# EAGLE schematic LeatherSynth (EAGLE 6.4)
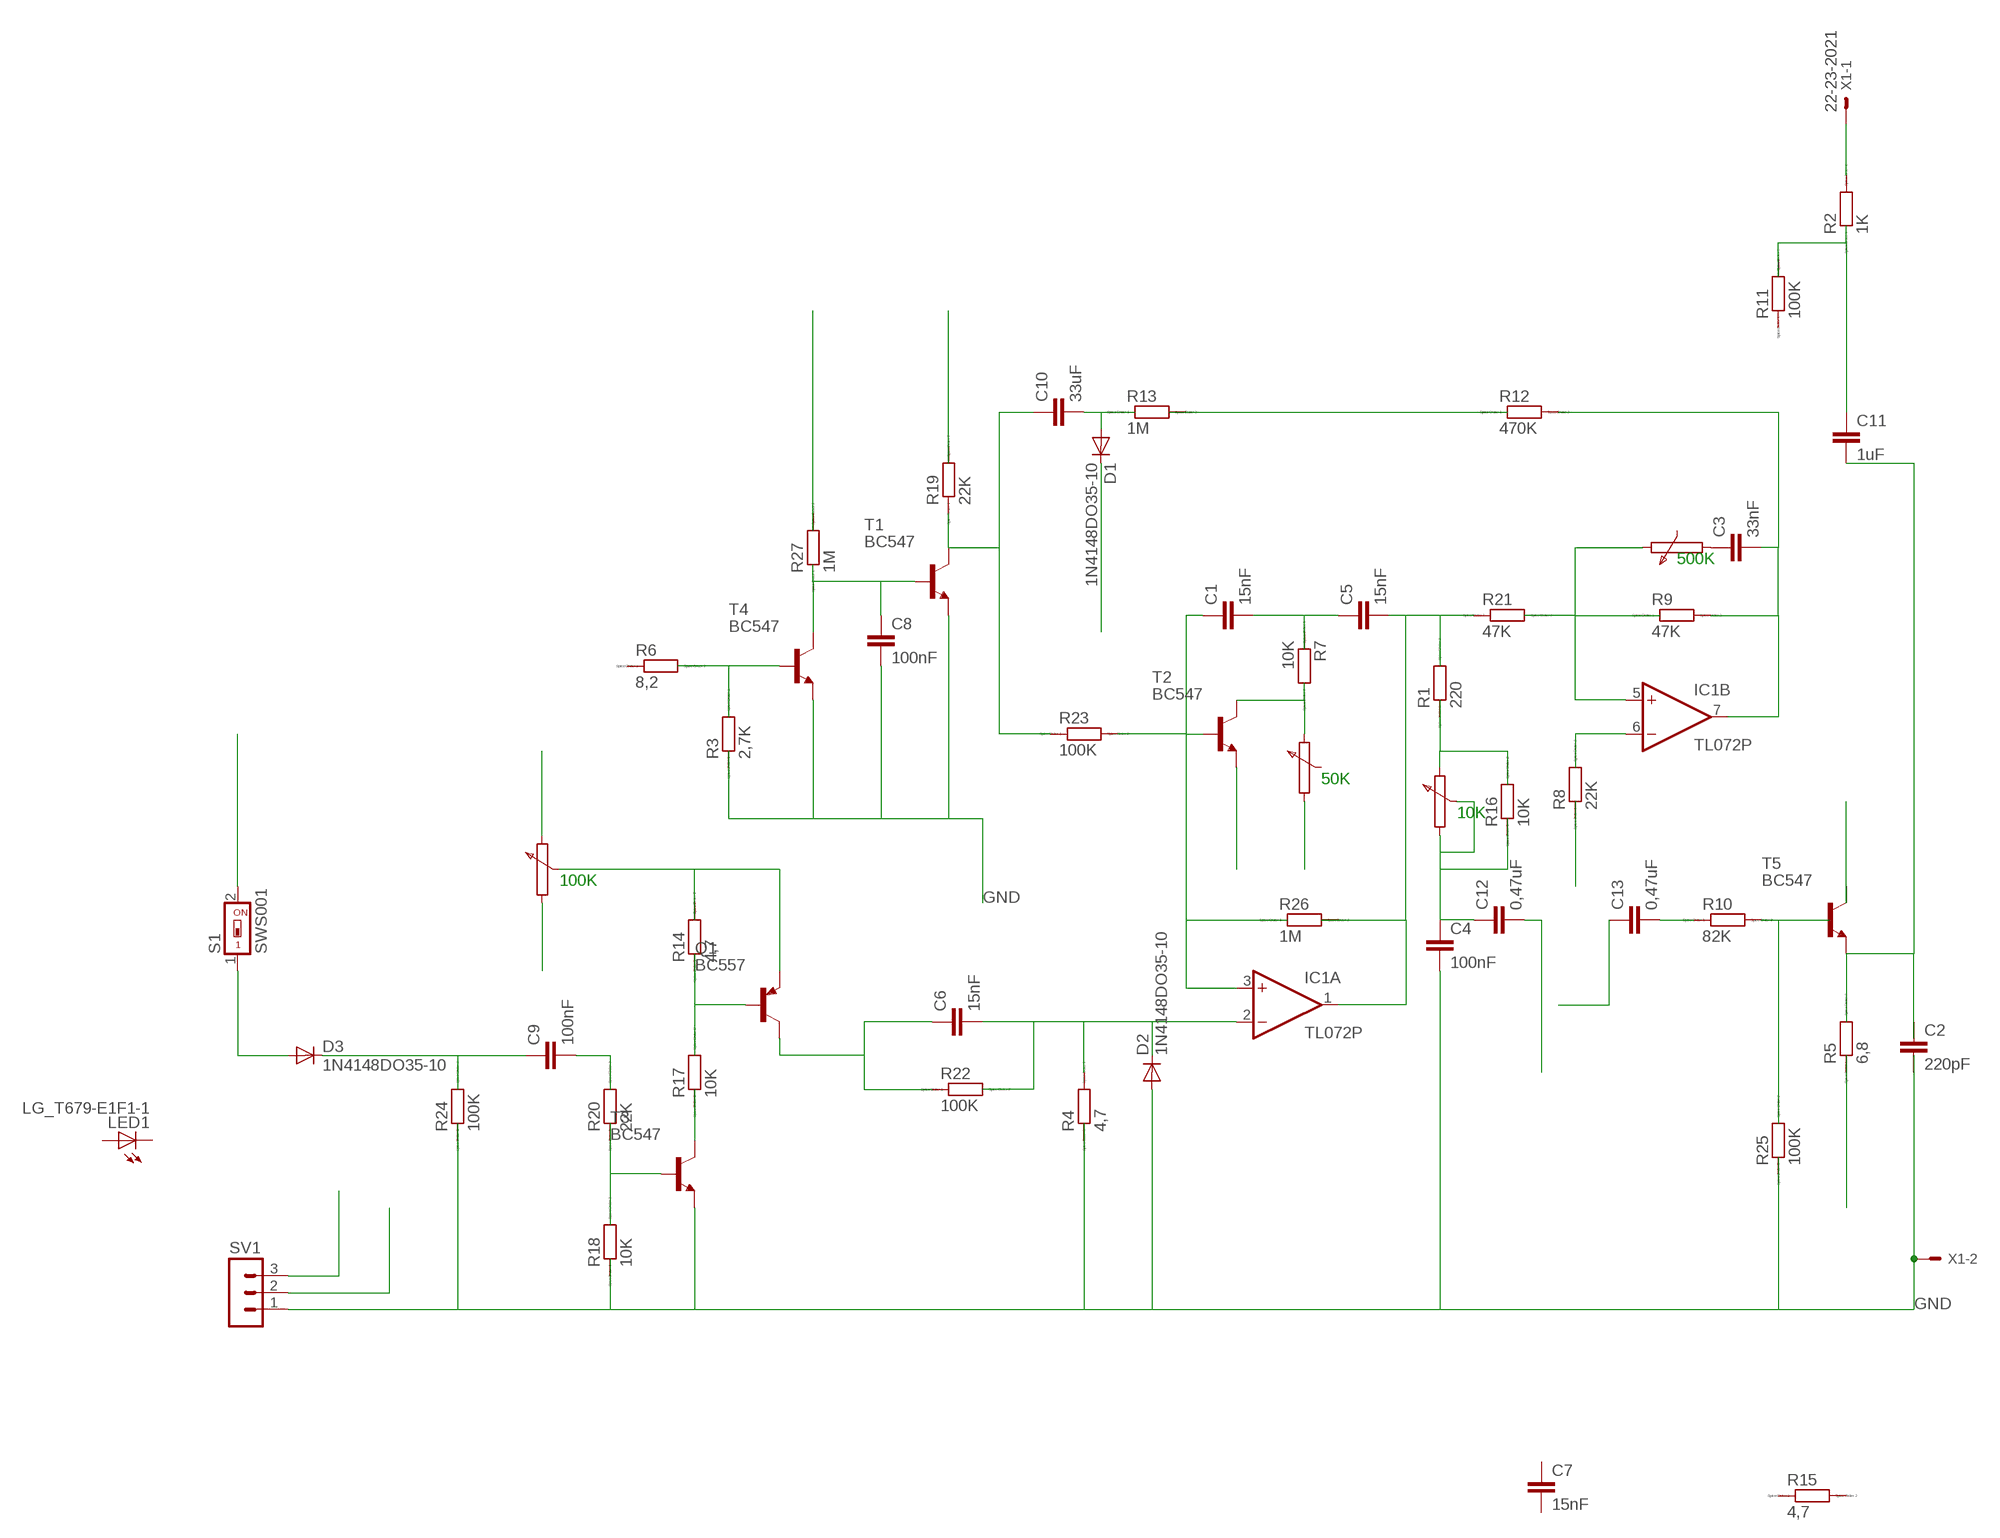
[diagram p0: schematic, sheet 1]

## Parts
C1  15nF  C-EUC2220K  [C2220K]
C2  220pF  C-EUC2220K  [C2220K]
C3  33nF  C-EUC2220K  [C2220K]
C4  100nF  C-EUC2220K  [C2220K]
C5  15nF  C-EUC2220K  [C2220K]
C6  15nF  C-EUC2220K  [C2220K]
C7  15nF  C-EUC2220K  [C2220K]
C8  100nF  C-EUC2220K  [C2220K]
C9  100nF  C-EUC2220K  [C2220K]
C10  33uF  C-EUC2220K  [C2220K]
C11  1uF  C-EUC2220K  [C2220K]
C12  0,47uF  C-EUC2220K  [C2220K]
C13  0,47uF  C-EUC2220K  [C2220K]
D1  1N4148DO35-10  [DO35-10]
D2  1N4148DO35-10  [DO35-10]
D3  1N4148DO35-10  [DO35-10]
IC1  TL072P  [DIL08]
LED1  LG_T679-E1F1-1  [PLCC2]
Q1  BC557  [TO92]
R1  220  RR2010  [R2010]
R2  1K  RR2010  [R2010]
R3  2,7K  RR2010  [R2010]
R4  4,7  RR2010  [R2010]
R5  6,8  RR2010  [R2010]
R6  8,2  RR2010  [R2010]
R7  10K  RR2010  [R2010]
R8  22K  RR2010  [R2010]
R9  47K  RR2010  [R2010]
R10  82K  RR2010  [R2010]
R11  100K  RR2010  [R2010]
R12  470K  RR2010  [R2010]
R13  1M  RR2010  [R2010]
R14  4,7  RR2010  [R2010]
R15  4,7  RR2010  [R2010]
R16  10K  RR2010  [R2010]
R17  10K  RR2010  [R2010]
R18  10K  RR2010  [R2010]
R19  22K  RR2010  [R2010]
R20  22K  RR2010  [R2010]
R21  47K  RR2010  [R2010]
R22  100K  RR2010  [R2010]
R23  100K  RR2010  [R2010]
R24  100K  RR2010  [R2010]
R25  100K  RR2010  [R2010]
R26  1M  RR2010  [R2010]
R27  1M  RR2010  [R2010]
S1  SWS001  [SMS-001]
SV1  MA03-1  [MA03-1]
T1  BC547  [TO92]
T2  BC547  [TO92]
T3  BC547  [TO92]
T4  BC547  [TO92]
T5  BC547  [TO92]
X1  22-23-2021  [22-23-2021]

## Nets
GND: C4.2 C8.2 D2.A SV1.1 T1.1(E) T3.1(E) T4.1(E) X1.2
N$2: C3.2 IC1.7(B:OUT) R9.2 R12.2
N$3: C10.1 R19.1 R23.1 T1.3(C)
N$4: IC1.5(B:+IN)
N$5: IC1.6(B:-IN)
N$7: C5.2 IC1.1(A:OUT) R21.1
N$10: C12.2
N$11: C13.1
N$12: C13.2 R10.1
N$13: R10.2
N$15: C11.1 R2.1
N$16: C11.2 T5.1(E)
N$17: SV1.3
N$18: C10.2 D1.A
N$19: SV1.2
N$20: C1.2 C5.1
N$21: R7.2 T2.3(C)
N$23: T2.1(E)
N$24: C1.1 IC1.3(A:+IN) R23.2 T2.2(B)
N$25: D1.C
N$26: C6.2 D2.C IC1.2(A:-IN) R4.2
N$31: C8.1 R27.1 T1.2(B) T4.3(C)
N$34: T4.2(B)
N$38: C6.1 Q1.3(C) R22.1
N$39: Q1.1(E)
N$42: Q1.2(B)
N$43: T3.3(C)
N$45: S1.2
N$46: D3.A S1.1
N$47: C9.1 D3.C
N$48: C9.2
N$49: T3.2(B)
N$52: R2.2 X1.1
N$53: C4.1 C12.1
Unconnected: C2.1 C2.2 C3.1 C7.1 C7.2 LED1.A LED1.C R1.1 R1.2 R3.1 R3.2 R4.1 R5.1 R5.2 R6.1 R6.2 R7.1 R8.1 R8.2 R9.1 R11.1 R11.2 R12.1 R13.1 R13.2 R14.1 R14.2 R15.1 R15.2 R16.1 R16.2 R17.1 R17.2 R18.1 R18.2 R19.2 R20.1 R20.2 R21.2 R22.2 R24.1 R24.2 R25.1 R25.2 R26.1 R26.2 R27.2 T5.2(B) T5.3(C)

## Notes on the sheet
- 500K
- 50K
- 10K
- 100K

## Power pins joined to a net without a drawn wire
V+: IC1.8(P:V+)
V-: IC1.4(P:V-)

## Library data of the parts
C1-C13 = rcl:C-EU: CAPACITOR, European symbol
D1-D3 = diode:1N4148: DIODE high speed (Philips)
IC1 = linear:TL072: OP AMP
LED1 = led:*_T679-?-1: LC TOPLED® Low Current LED Source: http://catalog.osram-os.com .. LG_LS_LY_T679_OBS.pdf; COLOR: green
Q1 = transistor-pnp:BC557: PNP Transistor
R1-R27 = eagle-ltspice:R: RESISTOR, European symbol; SPICEMODEL: NONE; SPICEPREFIX: R
S1 = smd-special:SWS001: SMD Dip Switch 1 pol.
SV1 = con-lstb:MA03-1: PIN HEADER; OC_FARNELL: unknown; OC_NEWARK: unknown
T1-T5 = transistor:BC547: NPN TRANSISTOR
X1 = con-molex:22-23-2021: .100" (2.54mm) Center Header - 2 Pin; MF: MOLEX; MPN: 22-23-2021; OC_FARNELL: 1462926; OC_NEWARK: 25C3832